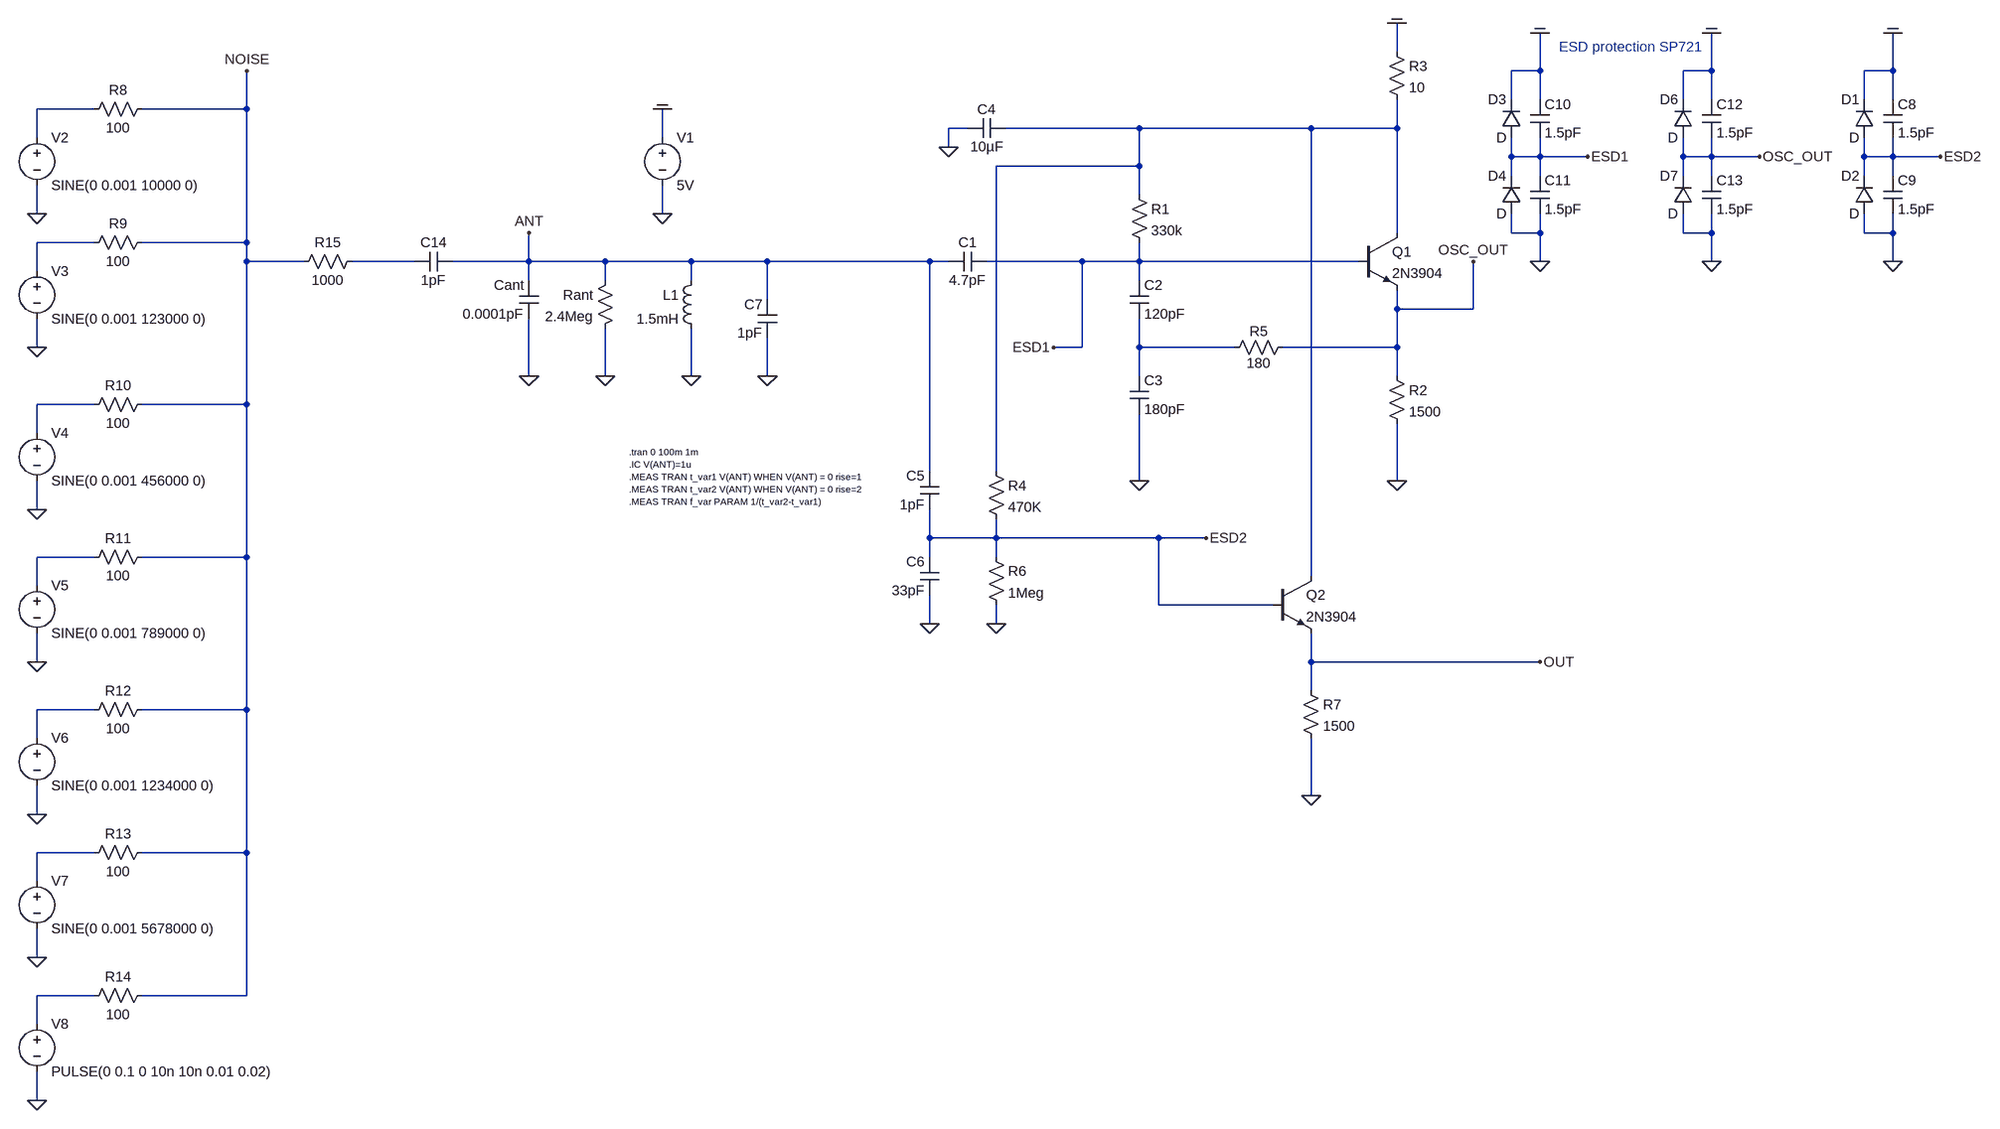
[diagram p0: schematic 2019_analog_oscill_sin_33v_noise_test_v01.asc]
2019_analog_oscill_sin_33v_noise_test_v01.asc, the LTspice schematic file:
Version 4
SHEET 1 2908 1620
WIRE 704 -160 704 -208
WIRE 944 -128 944 -192
WIRE 944 -128 896 -128
WIRE 1232 -128 1232 -192
WIRE 1232 -128 1184 -128
WIRE 1536 -128 1536 -192
WIRE 1536 -128 1488 -128
WIRE 896 -80 896 -128
WIRE 944 -80 944 -128
WIRE 1184 -80 1184 -128
WIRE 1232 -80 1232 -128
WIRE 1488 -80 1488 -128
WIRE 1536 -80 1536 -128
WIRE -1488 -64 -1584 -64
WIRE -1232 -64 -1232 -128
WIRE -1232 -64 -1408 -64
WIRE -16 -32 -48 -32
WIRE 272 -32 48 -32
WIRE 560 -32 272 -32
WIRE 704 -32 704 -80
WIRE 704 -32 560 -32
WIRE -1584 -16 -1584 -64
WIRE -528 -16 -528 -64
WIRE -48 0 -48 -32
WIRE 896 16 896 -16
WIRE 944 16 944 -16
WIRE 944 16 896 16
WIRE 1024 16 944 16
WIRE 1184 16 1184 -16
WIRE 1232 16 1232 -16
WIRE 1232 16 1184 16
WIRE 1312 16 1232 16
WIRE 1488 16 1488 -16
WIRE 1536 16 1536 -16
WIRE 1536 16 1488 16
WIRE 1616 16 1536 16
WIRE 272 32 272 -32
WIRE 272 32 32 32
WIRE 896 48 896 16
WIRE 944 48 944 16
WIRE 1184 48 1184 16
WIRE 1232 48 1232 16
WIRE 1488 48 1488 16
WIRE 1536 48 1536 16
WIRE 272 80 272 32
WIRE -1584 112 -1584 64
WIRE -528 112 -528 64
WIRE 704 144 704 -32
WIRE 896 144 896 112
WIRE 944 144 944 112
WIRE 944 144 896 144
WIRE 1184 144 1184 112
WIRE 1232 144 1232 112
WIRE 1232 144 1184 144
WIRE 1488 144 1488 112
WIRE 1536 144 1536 112
WIRE 1536 144 1488 144
WIRE -1488 160 -1584 160
WIRE -1232 160 -1232 -64
WIRE -1232 160 -1408 160
WIRE -1232 192 -1232 160
WIRE -1136 192 -1232 192
WIRE -944 192 -1056 192
WIRE -752 192 -752 144
WIRE -752 192 -880 192
WIRE -624 192 -752 192
WIRE -480 192 -624 192
WIRE -352 192 -480 192
WIRE -80 192 -352 192
WIRE -48 192 -80 192
WIRE 176 192 16 192
WIRE 272 192 272 160
WIRE 272 192 176 192
WIRE 640 192 272 192
WIRE 944 192 944 144
WIRE 1232 192 1232 144
WIRE 1536 192 1536 144
WIRE -1584 208 -1584 160
WIRE -752 224 -752 192
WIRE -624 224 -624 192
WIRE -480 224 -480 192
WIRE 272 224 272 192
WIRE -352 256 -352 192
WIRE 704 272 704 240
WIRE 832 272 832 192
WIRE 832 272 704 272
WIRE -1584 336 -1584 288
WIRE 176 336 176 192
WIRE 176 336 128 336
WIRE 272 336 272 288
WIRE 432 336 272 336
WIRE 704 336 704 272
WIRE 704 336 512 336
WIRE -752 384 -752 288
WIRE -624 384 -624 304
WIRE -480 384 -480 304
WIRE -352 384 -352 320
WIRE 272 384 272 336
WIRE 704 384 704 336
WIRE -1488 432 -1584 432
WIRE -1232 432 -1232 192
WIRE -1232 432 -1408 432
WIRE -1584 480 -1584 432
WIRE -80 544 -80 192
WIRE 32 544 32 32
WIRE 272 560 272 448
WIRE 704 560 704 464
WIRE -1584 608 -1584 560
WIRE -80 656 -80 608
WIRE 32 656 32 624
WIRE 32 656 -80 656
WIRE 304 656 32 656
WIRE 384 656 304 656
WIRE -1488 688 -1584 688
WIRE -1232 688 -1232 432
WIRE -1232 688 -1408 688
WIRE -80 688 -80 656
WIRE 32 688 32 656
WIRE 560 720 560 -32
WIRE -1584 736 -1584 688
WIRE 304 768 304 656
WIRE 496 768 304 768
WIRE -80 800 -80 752
WIRE 32 800 32 768
WIRE -1584 864 -1584 816
WIRE 560 864 560 816
WIRE 944 864 560 864
WIRE 560 912 560 864
WIRE -1488 944 -1584 944
WIRE -1232 944 -1232 688
WIRE -1232 944 -1408 944
WIRE -1584 992 -1584 944
WIRE 560 1088 560 992
WIRE -1584 1120 -1584 1072
WIRE -1488 1184 -1584 1184
WIRE -1232 1184 -1232 944
WIRE -1232 1184 -1408 1184
WIRE -1584 1232 -1584 1184
WIRE -1584 1360 -1584 1312
WIRE -1488 1424 -1584 1424
WIRE -1232 1424 -1232 1184
WIRE -1232 1424 -1408 1424
WIRE -1584 1472 -1584 1424
WIRE -1584 1600 -1584 1552
FLAG -528 112 0
FLAG -752 384 0
FLAG -752 144 ANT
FLAG -480 384 0
FLAG 272 560 0
FLAG 704 560 0
FLAG -624 384 0
FLAG -48 0 0
FLAG 832 192 OSC_OUT
FLAG -528 -64 COM
FLAG 704 -208 COM
FLAG 944 192 0
FLAG 944 -192 COM
FLAG 1024 16 ESD1
FLAG 1232 192 0
FLAG 1232 -192 COM
FLAG 1312 16 OSC_OUT
FLAG 128 336 ESD1
FLAG 944 864 OUT
FLAG -80 800 0
FLAG 32 800 0
FLAG 560 1088 0
FLAG -352 384 0
FLAG 1536 192 0
FLAG 1536 -192 COM
FLAG 1616 16 ESD2
FLAG 384 656 ESD2
FLAG -1584 112 0
FLAG -1584 336 0
FLAG -1232 -128 NOISE
FLAG -1584 608 0
FLAG -1584 864 0
FLAG -1584 1120 0
FLAG -1584 1360 0
FLAG -1584 1600 0
SYMBOL cap 256 224 R0
SYMATTR InstName C2
SYMATTR Value 120pF
SYMBOL res 256 64 R0
SYMATTR InstName R1
SYMATTR Value 330k
SYMBOL voltage -528 -32 R0
WINDOW 123 0 0 Left 2
WINDOW 39 0 0 Left 2
SYMATTR InstName V1
SYMATTR Value 5V
SYMBOL ind -464 208 M0
SYMATTR InstName L1
SYMATTR Value 1.5mH
SYMATTR SpiceLine Ipk=0.1 Rser=120 Rpar=9Meg Cpar=1.76pF
SYMBOL cap -736 224 M0
SYMATTR InstName Cant
SYMATTR Value 0.0001pF
SYMBOL cap -48 176 M90
WINDOW 0 0 32 VBottom 2
WINDOW 3 32 32 VTop 2
SYMATTR InstName C1
SYMATTR Value 4.7pF
SYMBOL npn 640 144 R0
SYMATTR InstName Q1
SYMATTR Value 2N3904
SYMBOL cap 256 384 R0
SYMATTR InstName C3
SYMATTR Value 180pF
SYMBOL res 688 368 R0
SYMATTR InstName R2
SYMATTR Value 1500
SYMBOL res -608 208 M0
SYMATTR InstName Rant
SYMATTR Value 2.4Meg
SYMBOL cap 48 -48 R90
WINDOW 0 0 32 VBottom 2
WINDOW 3 32 32 VTop 2
SYMATTR InstName C4
SYMATTR Value 10µF
SYMBOL res 688 -176 R0
SYMATTR InstName R3
SYMATTR Value 10
SYMBOL res 528 320 R90
WINDOW 0 5 56 VBottom 2
WINDOW 3 27 56 VTop 2
SYMATTR InstName R5
SYMATTR Value 180
SYMBOL diode 912 -16 R180
WINDOW 0 24 64 Left 2
WINDOW 3 24 0 Left 2
SYMATTR InstName D3
SYMBOL diode 912 112 R180
WINDOW 0 24 64 Left 2
WINDOW 3 24 0 Left 2
SYMATTR InstName D4
SYMBOL cap 928 -80 R0
SYMATTR InstName C10
SYMATTR Value 1.5pF
SYMBOL cap 928 48 R0
SYMATTR InstName C11
SYMATTR Value 1.5pF
SYMBOL diode 1200 -16 R180
WINDOW 0 24 64 Left 2
WINDOW 3 24 0 Left 2
SYMATTR InstName D6
SYMBOL diode 1200 112 R180
WINDOW 0 24 64 Left 2
WINDOW 3 24 0 Left 2
SYMATTR InstName D7
SYMBOL cap 1216 -80 R0
SYMATTR InstName C12
SYMATTR Value 1.5pF
SYMBOL cap 1216 48 R0
SYMATTR InstName C13
SYMATTR Value 1.5pF
SYMBOL cap -64 544 M0
SYMATTR InstName C5
SYMATTR Value 1pF
SYMBOL cap -64 688 M0
SYMATTR InstName C6
SYMATTR Value 33pF
SYMBOL res 16 528 R0
SYMATTR InstName R4
SYMATTR Value 470K
SYMBOL res 16 672 R0
SYMATTR InstName R6
SYMATTR Value 1Meg
SYMBOL npn 496 720 R0
SYMATTR InstName Q2
SYMATTR Value 2N3904
SYMBOL res 544 896 R0
SYMATTR InstName R7
SYMATTR Value 1500
SYMBOL cap -336 256 M0
SYMATTR InstName C7
SYMATTR Value 1pF
SYMBOL diode 1504 -16 R180
WINDOW 0 24 64 Left 2
WINDOW 3 24 0 Left 2
SYMATTR InstName D1
SYMBOL diode 1504 112 R180
WINDOW 0 24 64 Left 2
WINDOW 3 24 0 Left 2
SYMATTR InstName D2
SYMBOL cap 1520 -80 R0
SYMATTR InstName C8
SYMATTR Value 1.5pF
SYMBOL cap 1520 48 R0
SYMATTR InstName C9
SYMATTR Value 1.5pF
SYMBOL voltage -1584 -32 R0
WINDOW 123 0 0 Left 0
WINDOW 39 0 0 Left 0
SYMATTR InstName V2
SYMATTR Value SINE(0 0.001 10000 0)
SYMBOL voltage -1584 192 R0
WINDOW 123 0 0 Left 0
WINDOW 39 0 0 Left 0
SYMATTR InstName V3
SYMATTR Value SINE(0 0.001 123000 0)
SYMBOL res -1392 -80 R90
WINDOW 0 0 56 VBottom 2
WINDOW 3 32 56 VTop 2
SYMATTR InstName R8
SYMATTR Value 100
SYMBOL res -1392 144 R90
WINDOW 0 0 56 VBottom 2
WINDOW 3 32 56 VTop 2
SYMATTR InstName R9
SYMATTR Value 100
SYMBOL cap -944 176 M90
WINDOW 0 0 32 VBottom 2
WINDOW 3 32 32 VTop 2
SYMATTR InstName C14
SYMATTR Value 1pF
SYMBOL voltage -1584 464 R0
WINDOW 123 0 0 Left 0
WINDOW 39 0 0 Left 0
SYMATTR InstName V4
SYMATTR Value SINE(0 0.001 456000 0)
SYMBOL res -1392 416 R90
WINDOW 0 0 56 VBottom 2
WINDOW 3 32 56 VTop 2
SYMATTR InstName R10
SYMATTR Value 100
SYMBOL voltage -1584 720 R0
WINDOW 123 0 0 Left 0
WINDOW 39 0 0 Left 0
SYMATTR InstName V5
SYMATTR Value SINE(0 0.001 789000 0)
SYMBOL res -1392 672 R90
WINDOW 0 0 56 VBottom 2
WINDOW 3 32 56 VTop 2
SYMATTR InstName R11
SYMATTR Value 100
SYMBOL voltage -1584 976 R0
WINDOW 123 0 0 Left 0
WINDOW 39 0 0 Left 0
SYMATTR InstName V6
SYMATTR Value SINE(0 0.001 1234000 0)
SYMBOL res -1392 928 R90
WINDOW 0 0 56 VBottom 2
WINDOW 3 32 56 VTop 2
SYMATTR InstName R12
SYMATTR Value 100
SYMBOL voltage -1584 1216 R0
WINDOW 123 0 0 Left 0
WINDOW 39 0 0 Left 0
SYMATTR InstName V7
SYMATTR Value SINE(0 0.001 5678000 0)
SYMBOL res -1392 1168 R90
WINDOW 0 0 56 VBottom 2
WINDOW 3 32 56 VTop 2
SYMATTR InstName R13
SYMATTR Value 100
SYMBOL voltage -1584 1456 R0
WINDOW 123 0 0 Left 0
WINDOW 39 0 0 Left 0
SYMATTR InstName V8
SYMATTR Value PULSE(0 0.1 0 10n 10n 0.01 0.02)
SYMBOL res -1392 1408 R90
WINDOW 0 0 56 VBottom 2
WINDOW 3 32 56 VTop 2
SYMATTR InstName R14
SYMATTR Value 100
SYMBOL res -1040 176 R90
WINDOW 0 0 56 VBottom 2
WINDOW 3 32 56 VTop 2
SYMATTR InstName R15
SYMATTR Value 1000
TEXT -584 512 Left 1 !.tran 0 100m 1m\n.IC V(ANT)=1u\n.MEAS TRAN t_var1 V(ANT) WHEN V(ANT) = 0 rise=1\n.MEAS TRAN t_var2 V(ANT) WHEN V(ANT) = 0 rise=2\n.MEAS TRAN f_var PARAM 1/(t_var2-t_var1)
TEXT 976 -168 Left 2 ;ESD protection SP721

The netlist it stands for:
* 2019_analog_oscill_sin_33v_noise_test_v01.asc
C2 ESD1 N005 120pF
R1 N002 ESD1 330k
V1 COM 0 5V
L1 ANT 0 1.5mH Ipk=0.1 Rser=120 Rpar=9Meg Cpar=1.76pF
Cant ANT 0 0.0001pF
C1 ANT ESD1 4.7pF
Q1 N002 ESD1 OSC_OUT 0 2N3904
C3 N005 0 180pF
R2 OSC_OUT 0 1500
Rant ANT 0 2.4Meg
C4 N002 0 10µF
R3 COM N002 10
R5 OSC_OUT N005 180
D3 ESD1 COM D
D4 0 ESD1 D
C10 COM ESD1 1.5pF
C11 ESD1 0 1.5pF
D6 OSC_OUT COM D
D7 0 OSC_OUT D
C12 COM OSC_OUT 1.5pF
C13 OSC_OUT 0 1.5pF
C5 ANT ESD2 1pF
C6 ESD2 0 33pF
R4 N002 ESD2 470K
R6 ESD2 0 1Meg
Q2 N002 ESD2 OUT 0 2N3904
R7 OUT 0 1500
C7 ANT 0 1pF
D1 ESD2 COM D
D2 0 ESD2 D
C8 COM ESD2 1.5pF
C9 ESD2 0 1.5pF
V2 N001 0 SINE(0 0.001 10000 0)
V3 N003 0 SINE(0 0.001 123000 0)
R8 NOISE N001 100
R9 NOISE N003 100
C14 N004 ANT 1pF
V4 N006 0 SINE(0 0.001 456000 0)
R10 NOISE N006 100
V5 N007 0 SINE(0 0.001 789000 0)
R11 NOISE N007 100
V6 N008 0 SINE(0 0.001 1234000 0)
R12 NOISE N008 100
V7 N009 0 SINE(0 0.001 5678000 0)
R13 NOISE N009 100
V8 N010 0 PULSE(0 0.1 0 10n 10n 0.01 0.02)
R14 NOISE N010 100
R15 N004 NOISE 1000
.model D D
.lib standard.dio
.model NPN NPN
.model PNP PNP
.lib standard.bjt
.tran 0 100m 1m
.IC V(ANT)=1u
.MEAS TRAN t_var1 V(ANT) WHEN V(ANT) = 0 rise=1
.MEAS TRAN t_var2 V(ANT) WHEN V(ANT) = 0 rise=2
.MEAS TRAN f_var PARAM 1/(t_var2-t_var1)
* ESD protection SP721
.backanno
.end